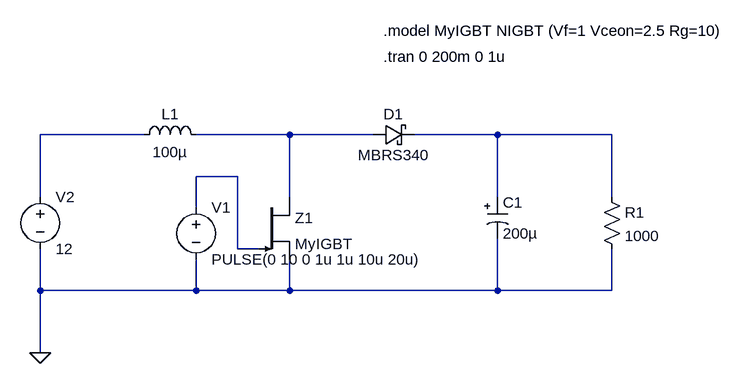
[diagram p0: schematic BoostConverter.asc]
BoostConverter.asc, the LTspice schematic file:
Version 4
SHEET 1 1028 680
WIRE 144 240 -16 240
WIRE 368 240 224 240
WIRE 496 240 368 240
WIRE 688 240 560 240
WIRE 864 240 688 240
WIRE 288 304 224 304
WIRE -16 336 -16 240
WIRE 368 336 368 240
WIRE 688 336 688 240
WIRE 864 336 864 240
WIRE 224 352 224 304
WIRE 288 416 288 304
WIRE 320 416 288 416
WIRE -16 480 -16 416
WIRE 224 480 224 432
WIRE 224 480 -16 480
WIRE 368 480 368 432
WIRE 368 480 224 480
WIRE 688 480 688 400
WIRE 688 480 368 480
WIRE 864 480 864 416
WIRE 864 480 688 480
WIRE -16 576 -16 480
FLAG -16 576 0
SYMBOL Misc/NIGBT 320 336 R0
SYMATTR InstName Z1
SYMATTR Value MyIGBT
SYMBOL ind 128 256 R270
WINDOW 0 32 56 VTop 2
WINDOW 3 5 56 VBottom 2
SYMATTR InstName L1
SYMATTR Value 100µ
SYMATTR SpiceLine Ipk=900m Rser=320m Rpar=86.02K Cpar=2.748p mfg="   ---" pn="   ---"
SYMBOL schottky 496 256 R270
WINDOW 0 32 32 VTop 2
WINDOW 3 0 32 VBottom 2
SYMATTR InstName D1
SYMATTR Value MBRS340
SYMATTR Description Diode
SYMATTR Type diode
SYMBOL polcap 672 336 R0
WINDOW 3 24 56 Left 2
SYMATTR InstName C1
SYMATTR Value 200µ
SYMATTR Description Capacitor
SYMATTR Type cap
SYMATTR SpiceLine V=X Rser=900m Lser=0 mfg="   ---" pn="   ---" type="   ---"
SYMBOL Res 848 320 R0
SYMATTR InstName R1
SYMATTR Value 1000
SYMBOL voltage 224 336 R0
SYMATTR InstName V1
SYMATTR Value PULSE(0 10 0 1u 1u 10u 20u)
SYMBOL voltage -16 320 R0
SYMATTR InstName V2
SYMATTR Value 12
TEXT 512 80 Left 2 !.model MyIGBT NIGBT (Vf=1 Vceon=2.5 Rg=10)
TEXT 512 120 Left 2 !.tran 0 200m 0 1u

The netlist it stands for:
* BoostConverter.asc
Z1 N002 N004 0 MyIGBT
L1 N001 N002 100µ Ipk=900m Rser=320m Rpar=86.02K Cpar=2.748p mfg="   ---" pn="   ---"
D1 N002 N003 MBRS340
C1 N003 0 200µ V=X Rser=900m Lser=0 mfg="   ---" pn="   ---" type="   ---"
R1 N003 0 1000
V1 N004 0 PULSE(0 10 0 1u 1u 10u 20u)
V2 N001 0 12
.model D D
.lib standard.dio
.model MyIGBT NIGBT (Vf=1 Vceon=2.5 Rg=10)
.tran 0 200m 0 1u
.backanno
.end